# EAGLE design tdc7201support (EAGLE 9.6.2)
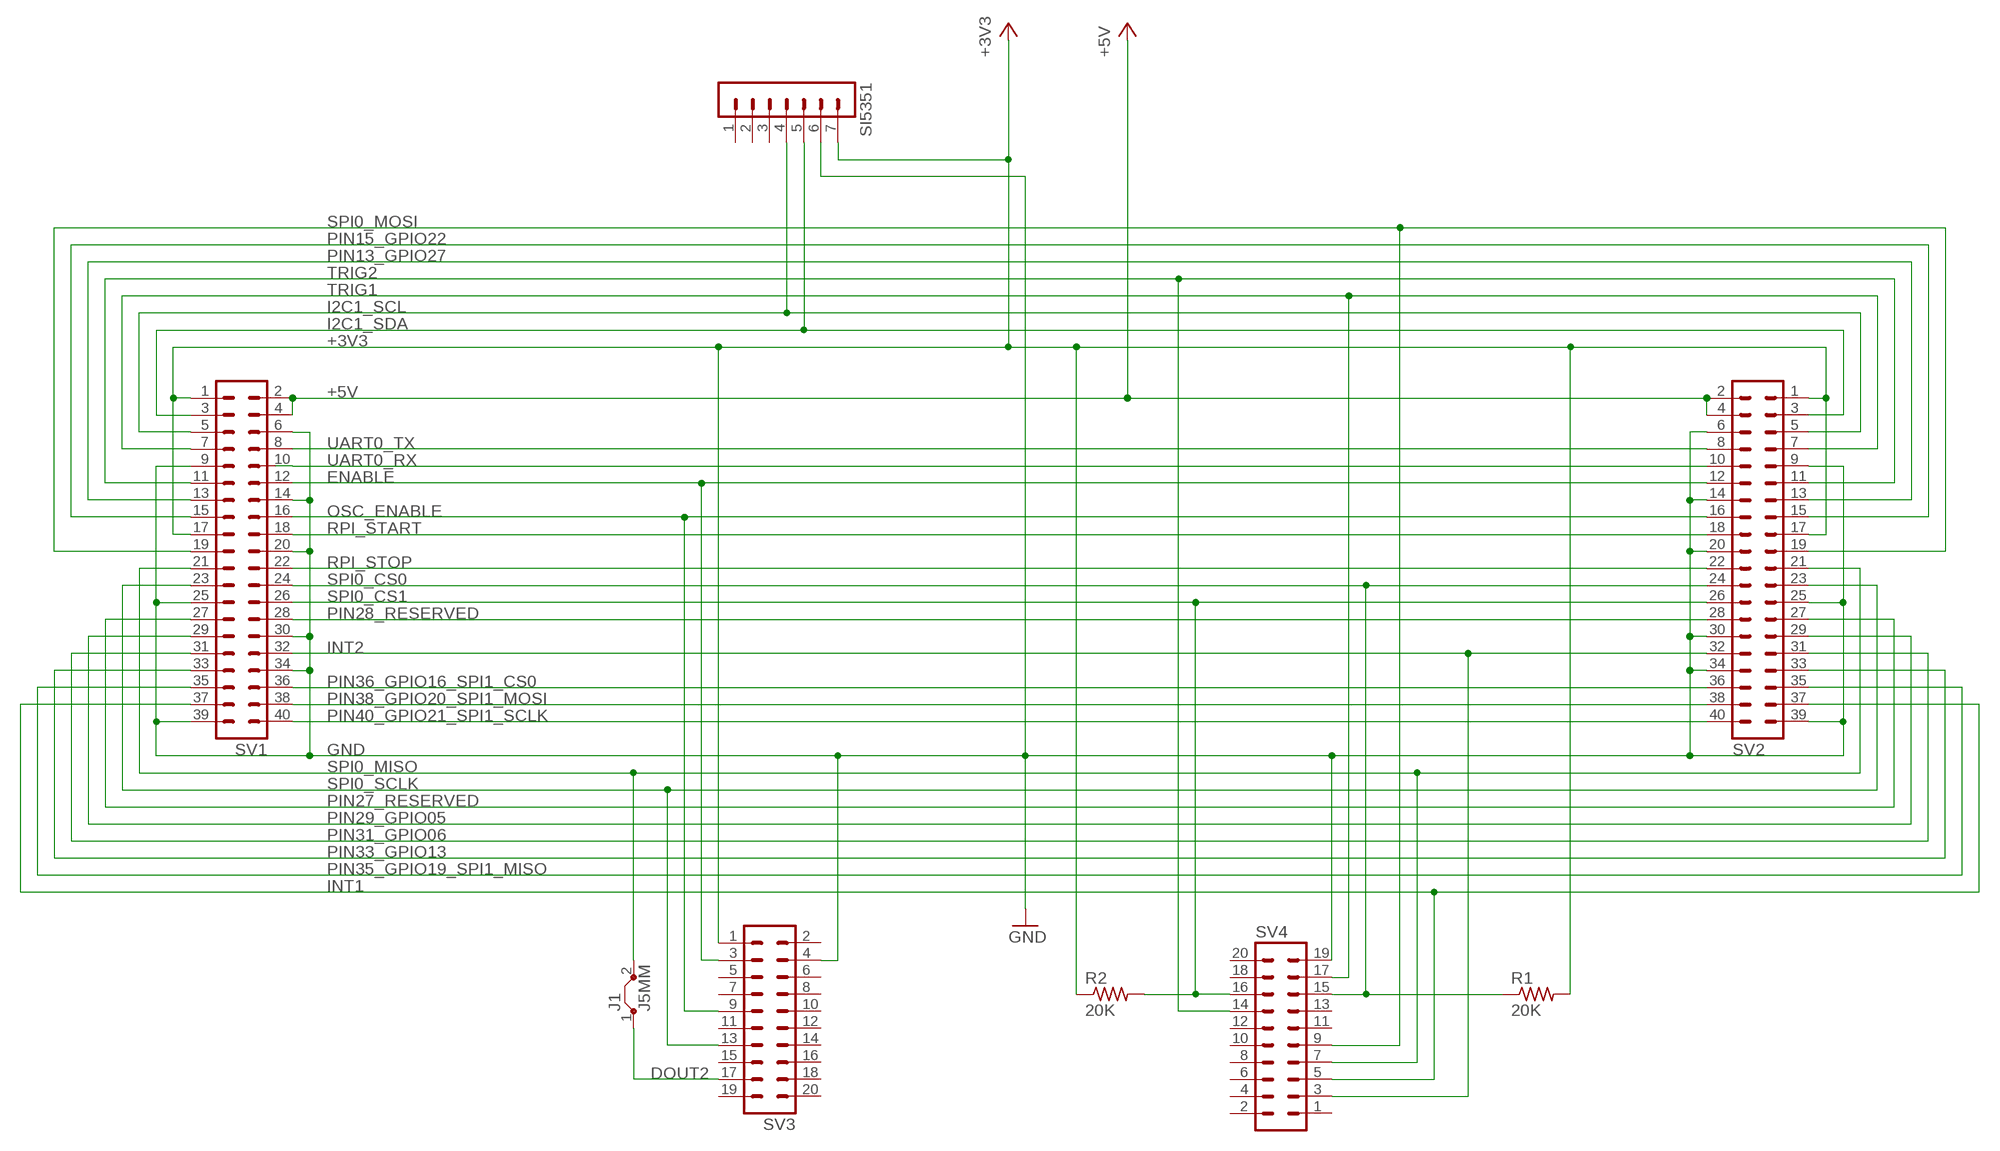
[diagram p0: schematic, sheet 1]

## Parts
J1  J5MM  [05]
R1  20K  R-US_0617/22  [0617/22]
R2  20K  R-US_0617/22  [0617/22]
SI5351  MA07-1  [MA07-1]
SV1  MA20-2  [MA20-2]
SV2  MA20-2  [MA20-2]
SV3  MA10-2  [MA10-2]
SV4  MA10-2  [MA10-2]

## Nets
+3V3: R1.2 R2.1 SI5351.7 SV1.1 SV1.17 SV2.1 SV2.17 SV3.1
+5V: SV1.2 SV1.4 SV2.2 SV2.4
DOUT2: J1.1 SV3.17
ENABLE: SV1.12 SV2.12 SV3.3
GND: SI5351.6 SV1.6 SV1.9 SV1.14 SV1.20 SV1.25 SV1.30 SV1.34 SV1.39 SV2.6 SV2.9 SV2.14 SV2.20 SV2.25 SV2.30 SV2.34 SV2.39 SV3.4 SV4.19
I2C1_SCL: SI5351.4 SV1.5 SV2.5
I2C1_SDA: SI5351.5 SV1.3 SV2.3
INT1: SV1.37 SV2.37 SV4.5
INT2: SV1.32 SV2.32 SV4.3
OSC_ENABLE: SV1.16 SV2.16 SV3.9
PIN13_GPIO27: SV1.13 SV2.13
PIN15_GPIO22: SV1.15 SV2.15
PIN27_RESERVED: SV1.27 SV2.27
PIN28_RESERVED: SV1.28 SV2.28
PIN29_GPIO05: SV1.29 SV2.29
PIN31_GPIO06: SV1.31 SV2.31
PIN33_GPIO13: SV1.33 SV2.33
PIN35_GPIO19_SPI1_MISO: SV1.35 SV2.35
PIN36_GPIO16_SPI1_CS0: SV1.36 SV2.36
PIN38_GPIO20_SPI1_MOSI: SV1.38 SV2.38
PIN40_GPIO21_SPI1_SCLK: SV1.40 SV2.40
RPI_START: SV1.18 SV2.18
RPI_STOP: SV1.22 SV2.22
SPI0_CS0: R1.1 SV1.24 SV2.24 SV4.15
SPI0_CS1: R2.2 SV1.26 SV2.26 SV4.16
SPI0_MISO: J1.2 SV1.21 SV2.21 SV4.7
SPI0_MOSI: SV1.19 SV2.19 SV4.9
SPI0_SCLK: SV1.23 SV2.23 SV3.13
TRIG1: SV1.7 SV2.7 SV4.17
TRIG2: SV1.11 SV2.11 SV4.14
UART0_RX: SV1.10 SV2.10
UART0_TX: SV1.8 SV2.8
Unconnected: SI5351.1 SI5351.2 SI5351.3 SV3.2 SV3.5 SV3.6 SV3.7 SV3.8 SV3.10 SV3.11 SV3.12 SV3.14 SV3.15 SV3.16 SV3.18 SV3.19 SV3.20 SV4.1 SV4.2 SV4.4 SV4.6 SV4.8 SV4.10 SV4.11 SV4.12 SV4.13 SV4.18 SV4.20

## Library data of the parts
J1 = jumper:J: Bridge
R1 R2 = resistor:R-US_: RESISTOR, American symbol
SI5351 = con-lstb:MA07-1: PIN HEADER; OC_FARNELL: unknown; OC_NEWARK: unknown
SV1 SV2 = con-lstb:MA20-2: PIN HEADER; OC_FARNELL: unknown; OC_NEWARK: unknown
SV3 SV4 = con-lstb:MA10-2: PIN HEADER; OC_FARNELL: unknown; OC_NEWARK: unknown

## Board
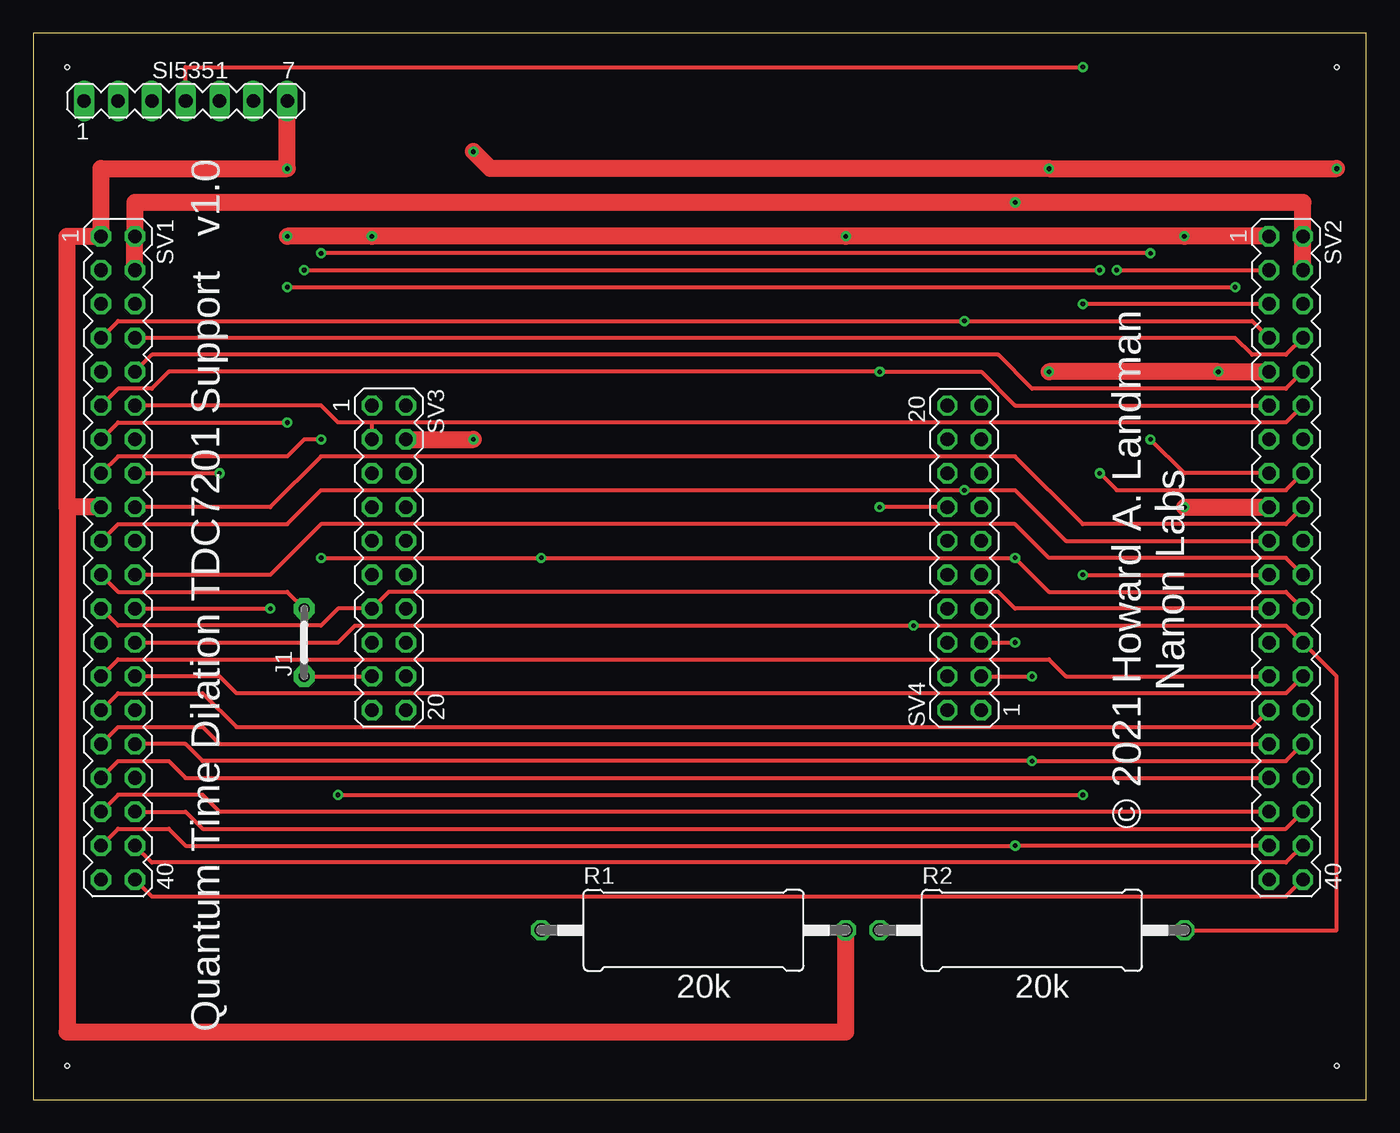
[diagram p1: board, top side]
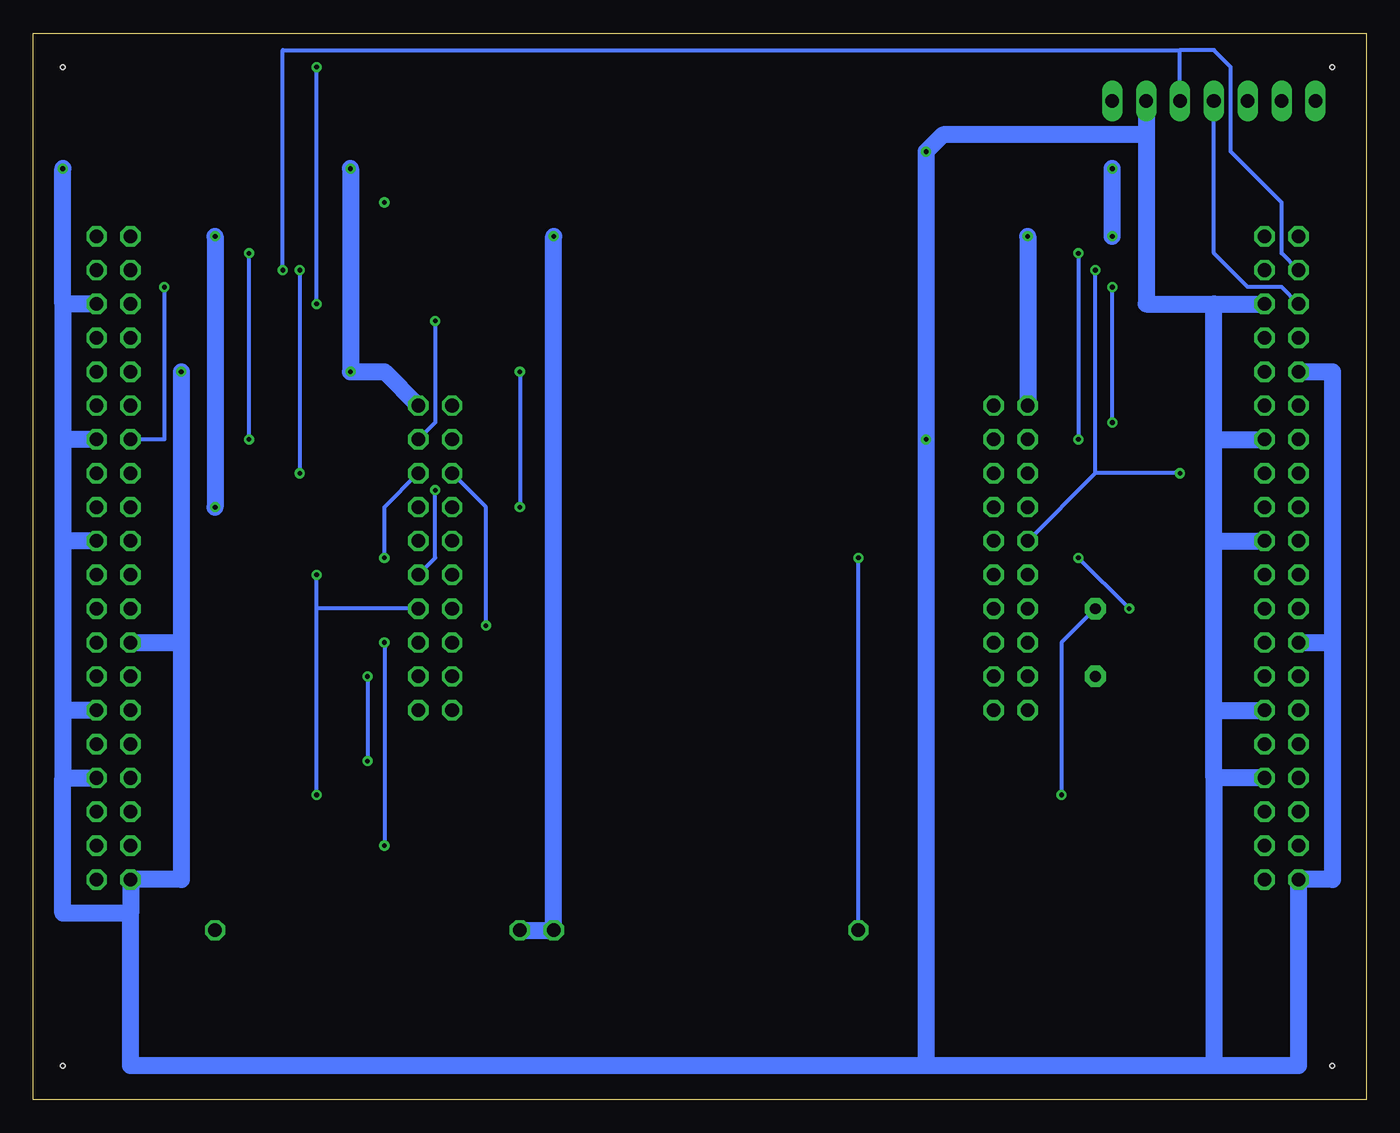
[diagram p2: board, bottom side, seen from below]

Size 100 x 80 mm. Coordinates in mm from the lower left corner, seen from the top.
Outline: 0,0 100,0 100,80 0,80 0,0
Copper layers (1*16): Top 0.035mm / dielectric 1.5mm / Bottom 0.035mm
Design rules "default": minimum track width 6mil, minimum drill 0.35mm, track to track 6mil, track to pad 6mil, pad to pad 6mil, via to via 6mil, smd to smd 6mil, copper to edge 40mil, drill to drill 6mil, minimum pad ring 10mil, minimum via ring 8mil, stop-mask expansion 4mil, vias tented up to drill 0mil, thermal gap 10mil
Holes 0.35 mm at 2.54,2.54 97.79,2.54 97.79,77.47 2.54,77.47

### Footprints (pad centres in the part's own frame; a part is rotated, then mirrored left to right if it is on the bottom)
05 = drill 0.813 pad 1.6 octagon: 1 -2.54,0; 2 2.54,0
0617/22 = drill 1.016 octagon: 1 -11.43,0; 2 11.43,0
MA07-1 = drill 1.016 long: 1 -7.62,0; 2 -5.08,0; 3 -2.54,0; 4 0,0; 5 2.54,0; 6 5.08,0; 7 7.62,0
MA20-2 = drill 1.016 octagon: 1 -24.13,-1.27; 2 -24.13,1.27; 3 -21.59,-1.27; 4 -21.59,1.27; 5 -19.05,-1.27; 6 -19.05,1.27; 7 -16.51,-1.27; 8 -16.51,1.27; 9 -13.97,-1.27; 10 -13.97,1.27; 11 -11.43,-1.27; 12 -11.43,1.27; 13 -8.89,-1.27; 14 -8.89,1.27; 15 -6.35,-1.27; 16 -6.35,1.27; 17 -3.81,-1.27; 18 -3.81,1.27; 19 -1.27,-1.27; 20 -1.27,1.27; 21 1.27,-1.27; 22 1.27,1.27; 23 3.81,-1.27; 24 3.81,1.27; 25 6.35,-1.27; 26 6.35,1.27; 27 8.89,-1.27; 28 8.89,1.27; 29 11.43,-1.27; 30 11.43,1.27; 31 13.97,-1.27; 32 13.97,1.27; 33 16.51,-1.27; 34 16.51,1.27; 35 19.05,-1.27; 36 19.05,1.27; 37 21.59,-1.27; 38 21.59,1.27; 39 24.13,-1.27; 40 24.13,1.27
MA10-2 = drill 1.016 octagon: 1 -11.43,-1.27; 2 -11.43,1.27; 3 -8.89,-1.27; 4 -8.89,1.27; 5 -6.35,-1.27; 6 -6.35,1.27; 7 -3.81,-1.27; 8 -3.81,1.27; 9 -1.27,-1.27; 10 -1.27,1.27; 11 1.27,-1.27; 12 1.27,1.27; 13 3.81,-1.27; 14 3.81,1.27; 15 6.35,-1.27; 16 6.35,1.27; 17 8.89,-1.27; 18 8.89,1.27; 19 11.43,-1.27; 20 11.43,1.27

### Placement (x,y rotation side)
J1  20.32,34.29 90 top
R1  49.53,12.7 0 top
R2  74.93,12.7 0 top
SI5351  11.43,74.93 0 top
SV1  6.35,40.64 270 top
SV2  93.98,40.64 270 top
SV3  26.67,40.64 270 top
SV4  69.85,40.64 90 top

### Tracks (layer width: path | path; a pad name or v marks a point on that pad's centre or on a via)
+3V3  (via drill 0.35)
  Top 1.27: SV1.17 2.54,44.45 | 2.54,44.45 2.54,64.77 SV1.1 5.08,69.85 v19.05,69.85 SI5351.7 | SV2.1 v86.36,64.77 v60.96,64.77 v25.4,64.77 v19.05,64.77 | v86.36,44.45 SV2.17 | 2.54,44.45 2.54,5.08 60.96,5.08 R1.2
  Bottom 1.27: v25.4,64.77 SV3.1 | R2.1 R1.2 v60.96,64.77 | v19.05,64.77 v19.05,69.85 | v86.36,64.77 v86.36,44.45
+5V  (via drill 0.35)
  Top 1.27: SV1.4 SV1.2 7.62,67.31 v73.66,67.31 95.25,67.31 SV2.2 SV2.4
DOUT2
  Top 0.305: J1.1 SV3.17
ENABLE
  Top 0.305: SV2.12 93.98,50.8 25.4,50.8 | SV1.12 21.59,52.07 22.86,50.8 25.4,50.8 | SV3.3 25.4,50.8
GND  (via drill 0.35)
  Top 1.27: v76.2,54.61 v88.9,54.61 SV2.9 | v33.02,71.12 34.29,69.85 v76.2,69.85 v97.79,69.85 | SV3.4 v33.02,49.53
  Bottom 1.27: SV2.6 97.79,59.69 | 97.79,59.69 97.79,49.53 | 97.79,49.53 97.79,41.91 | 97.79,41.91 97.79,29.21 | 97.79,29.21 97.79,24.13 | 97.79,24.13 SV2.34 | SV2.14 97.79,49.53 | SV2.20 97.79,41.91 | SV2.30 97.79,29.21 | 92.71,13.97 SV2.39 88.9,16.51 88.9,34.29 | 92.71,13.97 97.79,13.97 97.79,24.13 | SV1.9 2.54,54.61 2.54,34.29 | 2.54,34.29 2.54,16.51 SV1.39 5.08,2.54 11.43,2.54 | 11.43,2.54 33.02,2.54 | 33.02,2.54 92.71,2.54 92.71,13.97 | SV1.25 2.54,34.29 | v88.9,54.61 88.9,34.29 | SV2.25 88.9,34.29 | SV1.34 11.43,24.13 | 11.43,24.13 11.43,2.54 | 11.43,24.13 11.43,29.21 | 11.43,29.21 SV1.30 | 11.43,29.21 11.43,41.91 | 11.43,41.91 SV1.20 | 11.43,41.91 11.43,49.53 | 11.43,49.53 SV1.14 | 11.43,49.53 11.43,59.69 | 11.43,59.69 SV1.6 | SV4.19 73.66,54.61 v76.2,54.61 v76.2,69.85 | 33.02,2.54 v33.02,49.53 v33.02,71.12 31.75,72.39 16.51,72.39 | SI5351.6 16.51,72.39 | 16.51,72.39 16.51,59.69 11.43,59.69 | 97.79,59.69 v97.79,69.85
I2C1_SCL  (via drill 0.35)
  Top 0.305: SI5351.4 11.43,77.47 v78.74,77.47 | SV2.5 v78.74,59.69
  Bottom 0.305: SV1.5 6.35,60.96 8.89,60.96 11.43,63.5 SI5351.4 | v78.74,59.69 v78.74,77.47
I2C1_SDA  (via drill 0.35)
  Top 0.305: v81.28,62.23 SV2.3
  Bottom 0.305: SV1.3 6.35,63.5 6.35,67.31 10.16,71.12 10.16,77.47 11.43,78.74 13.97,78.74 | 13.97,78.74 81.28,78.74 v81.28,62.23 | SI5351.5 13.97,78.74
INT1  (via drill 0.35)
  Top 0.305: SV2.37 v73.66,19.05 11.43,19.05 10.16,20.32 6.35,20.32 SV1.37 | SV4.5 v73.66,34.29
  Bottom 0.305: v73.66,34.29 v73.66,19.05
INT2  (via drill 0.35)
  Top 0.305: SV2.32 93.98,25.4 v74.93,25.4 12.7,25.4 11.43,26.67 SV1.32 | SV4.3 v74.93,31.75
  Bottom 0.305: v74.93,31.75 v74.93,25.4
OSC_ENABLE  (via drill 0.35)
  Top 0.305: v20.32,62.23 v80.01,62.23 | v80.01,46.99 81.28,45.72 93.98,45.72 SV2.16 | SV1.16 v13.97,46.99
  Bottom 0.305: SV3.9 20.32,46.99 | 20.32,46.99 v20.32,62.23 | v80.01,62.23 v80.01,46.99 | v13.97,46.99 20.32,46.99
PIN13_GPIO27  (via drill 0.35)
  Top 0.305: SV1.13 6.35,50.8 v19.05,50.8 | v19.05,60.96 v90.17,60.96
  Bottom 0.305: v19.05,50.8 v19.05,60.96 | v90.17,60.96 90.17,49.53 SV2.13
PIN15_GPIO22  (via drill 0.35)
  Top 0.305: SV2.15 86.36,46.99 v83.82,49.53 | v83.82,63.5 v21.59,63.5 | v21.59,49.53 20.32,49.53 19.05,48.26 6.35,48.26 SV1.15
  Bottom 0.305: v83.82,49.53 v83.82,63.5 | v21.59,63.5 v21.59,49.53
PIN27_RESERVED
  Top 0.305: SV1.27 6.35,33.02 76.2,33.02 77.47,31.75 SV2.27
PIN28_RESERVED
  Top 0.305: SV2.28 93.98,30.48 15.24,30.48 13.97,31.75 SV1.28
PIN29_GPIO05
  Top 0.305: SV1.29 6.35,30.48 12.7,30.48 15.24,27.94 91.44,27.94 SV2.29
PIN31_GPIO06
  Top 0.305: SV1.31 6.35,27.94 12.7,27.94 13.97,26.67 SV2.31
PIN33_GPIO13
  Top 0.305: SV1.33 6.35,25.4 10.16,25.4 11.43,24.13 SV2.33
PIN35_GPIO19_SPI1_MISO
  Top 0.305: SV2.35 13.97,21.59 12.7,22.86 6.35,22.86 SV1.35
PIN36_GPIO16_SPI1_CS0
  Top 0.305: SV1.36 11.43,21.59 12.7,20.32 93.98,20.32 SV2.36
PIN38_GPIO20_SPI1_MOSI
  Top 0.305: SV2.38 93.98,17.78 8.89,17.78 SV1.38
PIN40_GPIO21_SPI1_SCLK
  Top 0.305: SV1.40 8.89,15.24 93.98,15.24 SV2.40
RPI_START
  Top 0.305: SV2.18 93.98,43.18 78.74,43.18 73.66,48.26 21.59,48.26 17.78,44.45 SV1.18
RPI_STOP
  Top 0.305: SV2.22 93.98,40.64 76.2,40.64 73.66,43.18 21.59,43.18 17.78,39.37 SV1.22
SPI0_CS0  (via drill 0.35)
  Top 0.305: SV1.24 v17.78,36.83 | v21.59,40.64 v38.1,40.64 v73.66,40.64 76.2,38.1 93.98,38.1 SV2.24
  Bottom 0.305: v17.78,36.83 v21.59,40.64 | v73.66,40.64 73.66,44.45 SV4.15 | R1.1 v38.1,40.64
SPI0_CS1  (via drill 0.35)
  Top 0.305: R2.2 97.79,12.7 97.79,31.75 SV2.26 93.98,35.56 v66.04,35.56 24.13,35.56 22.86,34.29 SV1.26
  Bottom 0.305: v66.04,35.56 66.04,44.45 SV4.16
SPI0_MISO  (via drill 0.35)
  Top 0.305: SV1.21 6.35,38.1 19.05,38.1 J1.2 | v22.86,22.86 v78.74,22.86 | v78.74,39.37 SV2.21
  Bottom 0.305: J1.2 22.86,34.29 v22.86,22.86 | 78.74,36.83 v78.74,39.37 | SV4.7 78.74,36.83 | v78.74,22.86 78.74,36.83
SPI0_MOSI  (via drill 0.35)
  Top 0.305: SV1.19 6.35,43.18 19.05,43.18 21.59,45.72 v69.85,45.72 73.66,45.72 77.47,41.91 SV2.19
  Bottom 0.305: SV4.9 69.85,40.64 v69.85,45.72
SPI0_SCLK
  Top 0.305: SV2.23 73.66,36.83 72.39,38.1 26.67,38.1 SV3.13 22.86,36.83 21.59,35.56 6.35,35.56 SV1.23
TRIG1  (via drill 0.35)
  Top 0.305: SV1.7 6.35,58.42 v69.85,58.42 91.44,58.42 SV2.7
  Bottom 0.305: v69.85,58.42 69.85,50.8 SV4.17
TRIG2  (via drill 0.35)
  Top 0.305: SV1.11 6.35,53.34 8.89,53.34 10.16,54.61 v63.5,54.61 71.12,54.61 73.66,52.07 SV2.11 | SV4.14 v63.5,44.45
  Bottom 0.305: v63.5,54.61 v63.5,44.45
UART0_RX
  Top 0.305: SV1.10 8.89,55.88 72.39,55.88 74.93,53.34 93.98,53.34 SV2.10
UART0_TX
  Top 0.305: SV2.8 93.98,55.88 91.44,55.88 90.17,57.15 SV1.8

### Text on the board
tPlace: v1.0 | © 2021 Howard A. Landman / Nanon Labs | 20k | 20k | Quantum Time Dilation TDC7201 Support